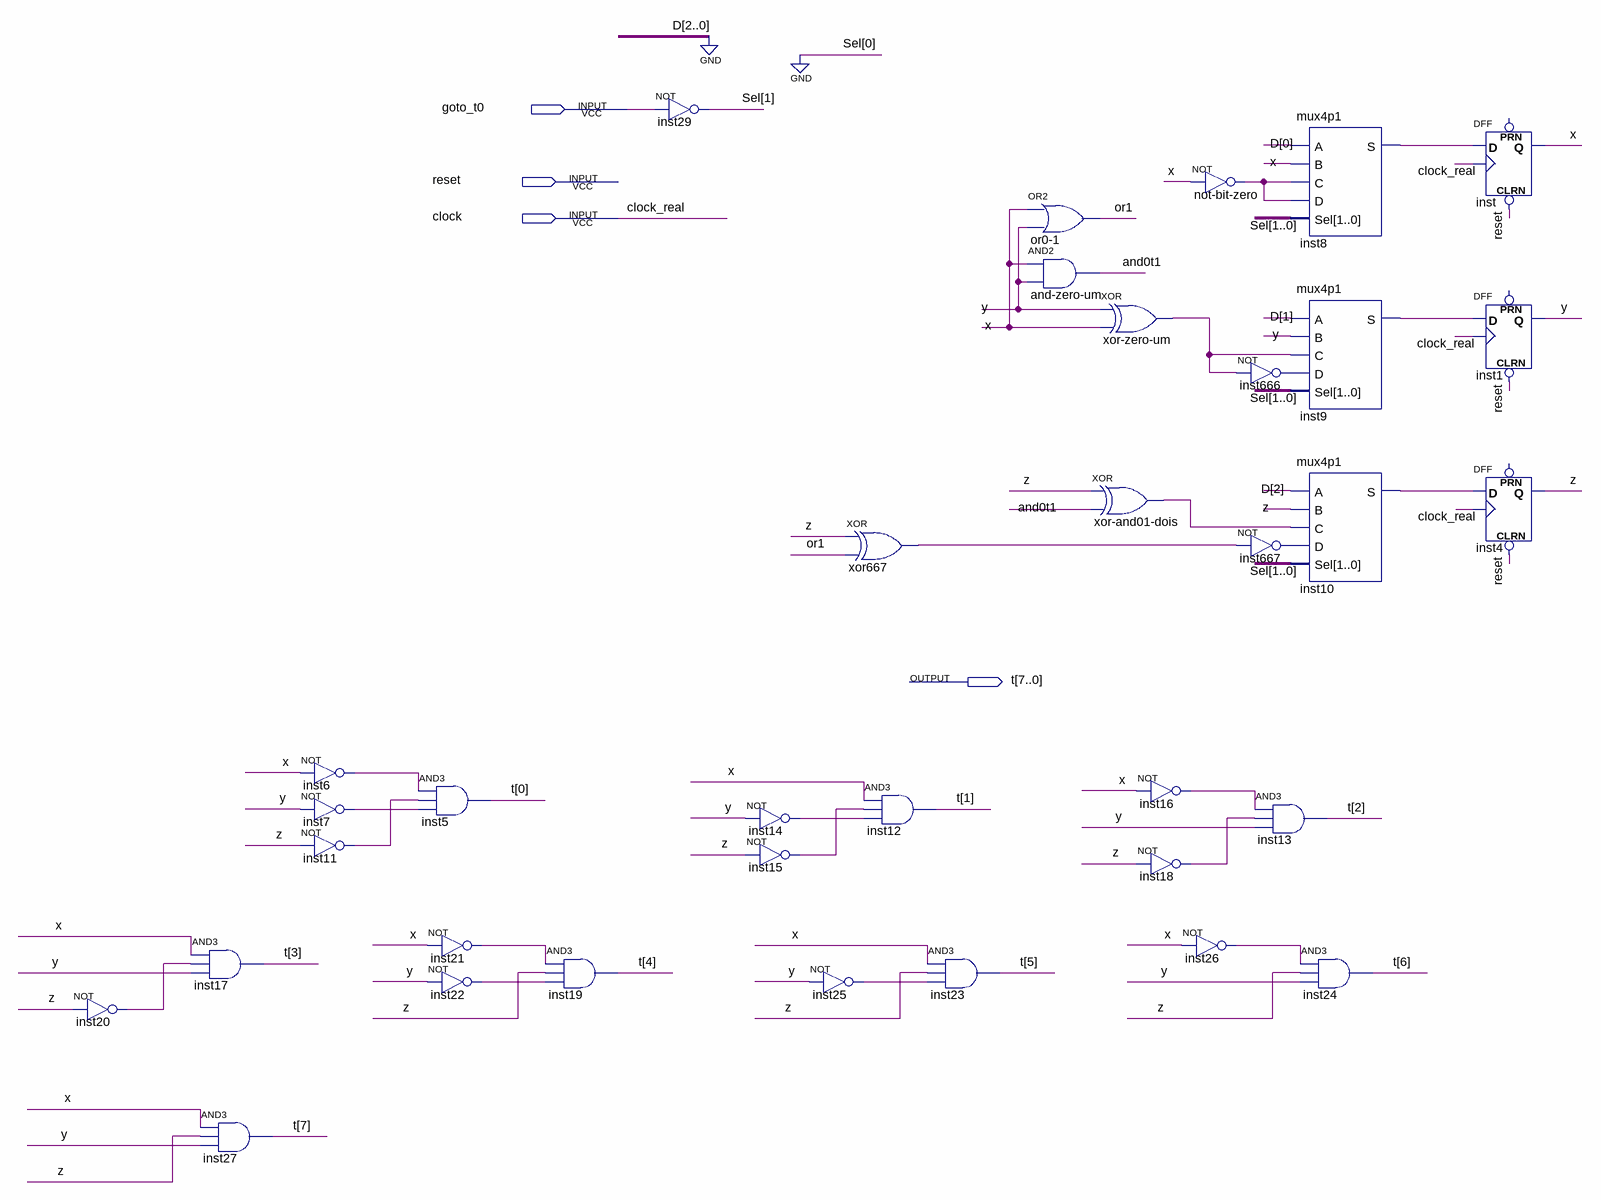
[diagram p0: schematic sheet]
// Quartus schematic timerNEANDER.bdf as structural Verilog: 35 symbols, 4 pins
module timerNEANDER (
  input  goto_t0,
  input  reset,
  input  clock,
  output [7:0] t
);

  wire and0t1, inst6_out, inst7_out, inst8_s, inst9_s, inst10_s, inst11_out, inst14_out, inst15_out,
       inst16_out, inst18_out, inst20_out, inst21_out, inst22_out, inst25_out, inst26_out, inst666_out,
       inst667_out, not_bit_zero_out, or1, x, xor667_out, xor_and01_dois_out, xor_zero_um_out, y, z;
  wire [1:1] Sel;

  not inst20 (inst20_out, z);
  and inst17 (t[3], x, inst20_out, y);
  and inst27 (t[7], x, z, y);
  not inst6 (inst6_out, x);
  not inst7 (inst7_out, y);
  not inst11 (inst11_out, z);
  and inst5 (t[0], inst6_out, inst11_out, inst7_out);
  not inst21 (inst21_out, x);
  not inst22 (inst22_out, y);
  and inst19 (t[4], inst21_out, z, inst22_out);
  not inst29 (Sel[1], goto_t0);
  not inst14 (inst14_out, y);
  not inst15 (inst15_out, z);
  not inst25 (inst25_out, y);
  xor xor667 (xor667_out, z, or1);
  and inst12 (t[1], x, inst15_out, inst14_out);
  and inst23 (t[5], x, z, inst25_out);
  or \or0-1  (or1, x, y);
  and \and-zero-um  (and0t1, x, y);
  xor \xor-zero-um  (xor_zero_um_out, y, x);
  xor \xor-and01-dois  (xor_and01_dois_out, z, and0t1);
  not inst16 (inst16_out, x);
  not inst18 (inst18_out, z);
  not inst26 (inst26_out, x);
  not \not-bit-zero  (not_bit_zero_out, x);
  not inst666 (inst666_out, xor_zero_um_out);
  not inst667 (inst667_out, xor667_out);
  and inst13 (t[2], inst16_out, inst18_out, y);
  mux4p1 inst8 (.A(1'b0), .B(x), .C(not_bit_zero_out), .D(not_bit_zero_out), .Sel({Sel[1], 1'b0}), .S(inst8_s));
  mux4p1 inst9 (.A(1'b0), .B(y), .C(xor_zero_um_out), .D(inst666_out), .Sel({Sel[1], 1'b0}), .S(inst9_s));
  mux4p1 inst10 (.A(1'b0), .B(z), .C(xor_and01_dois_out), .D(inst667_out), .Sel({Sel[1], 1'b0}), .S(inst10_s));
  and inst24 (t[6], inst26_out, z, y);
  DFF inst (.CLRN(reset), .CLK(clock), .D(inst8_s), .Q(x));  // open: PRN
  DFF inst1 (.CLRN(reset), .CLK(clock), .D(inst9_s), .Q(y));  // open: PRN
  DFF inst4 (.CLRN(reset), .CLK(clock), .D(inst10_s), .Q(z));  // open: PRN

  // Other names for the same wires on the sheet: clock_real = clock
endmodule
